# EAGLE schematic clock_from_gps (EAGLE 6.1)
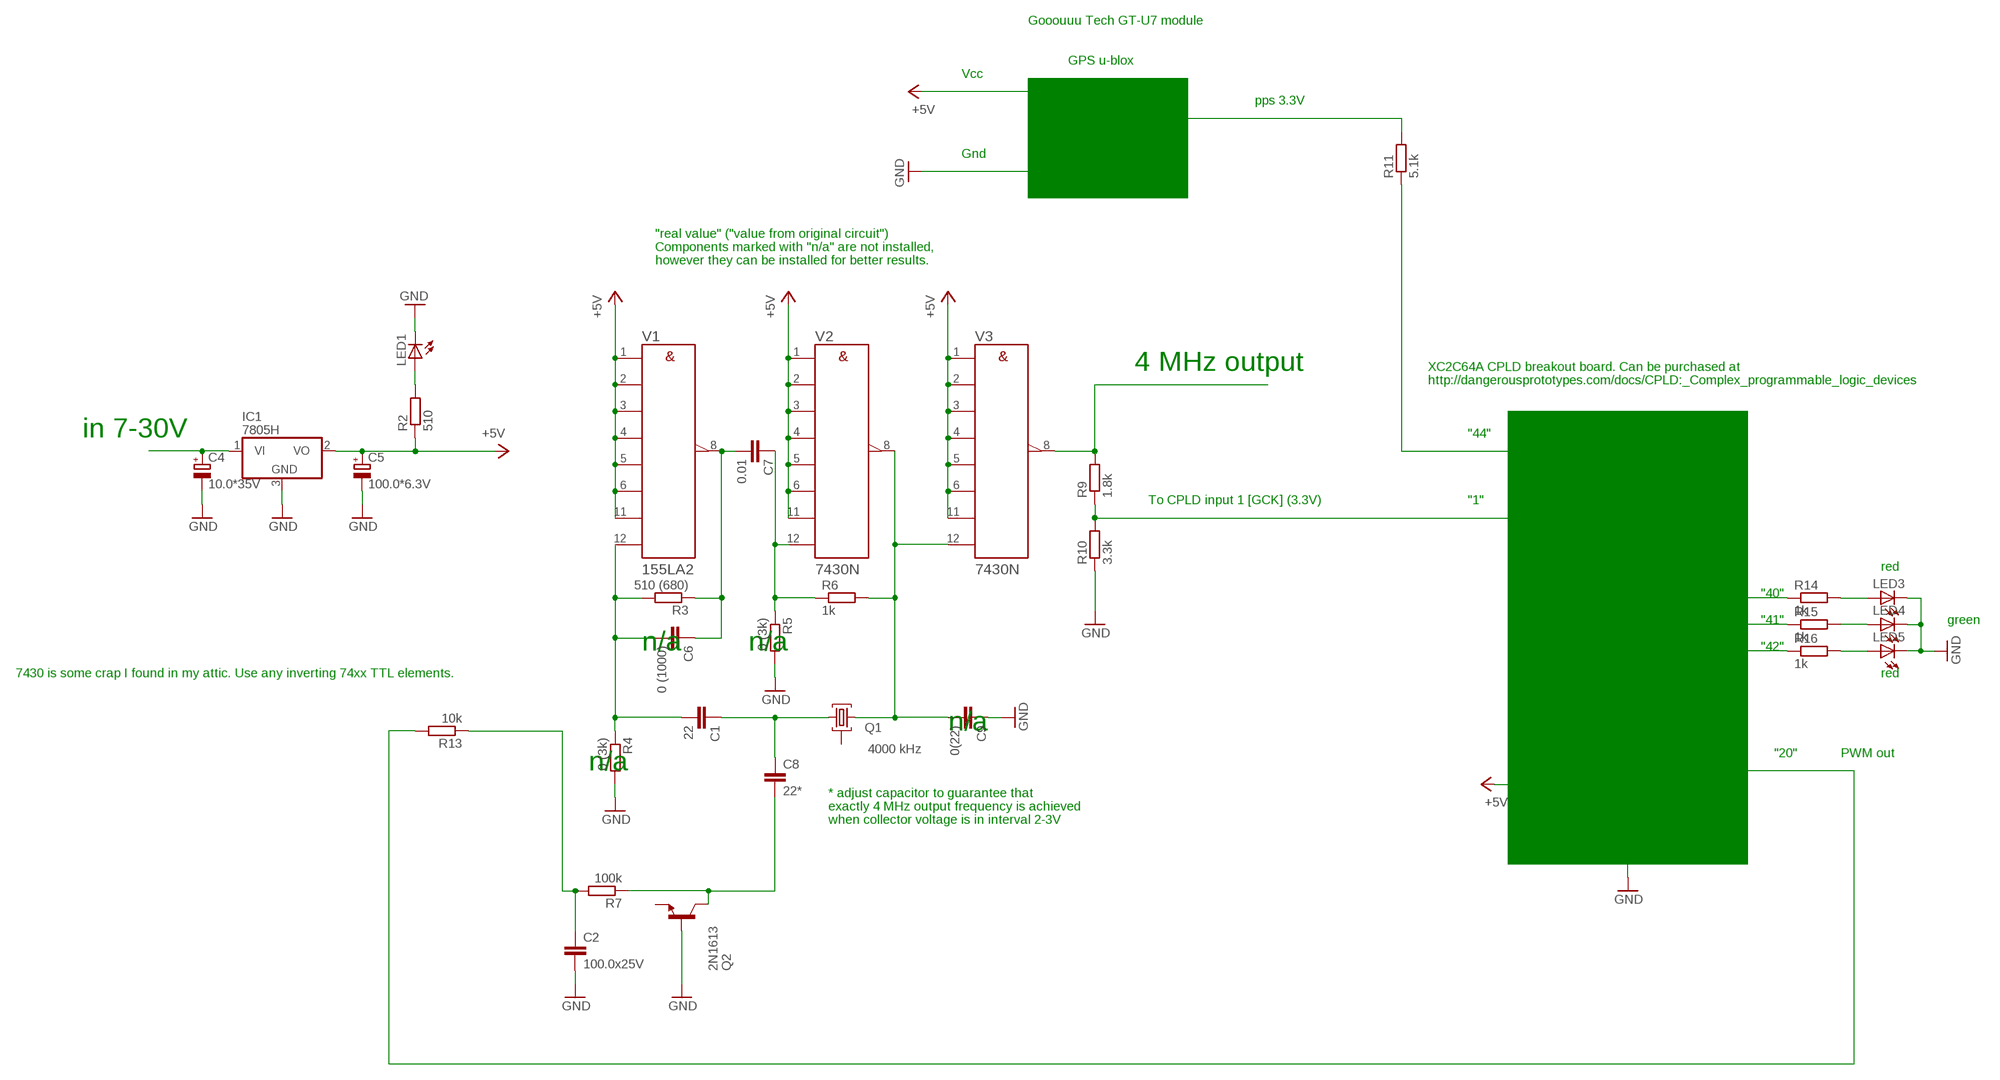
[diagram p0: schematic, sheet 1]

## Parts
C1  22  C-EU025-024X044  [C025-024X044]
C2  100.0x25V  C-EU025-024X044  [C025-024X044]
C4  10.0*35V  CPOL-EUE5-4  [E5-4]
C5  100.0*6.3V  CPOL-EUE5-4  [E5-4]
C6  0 (1000)  C-EU025-024X044  [C025-024X044]
C7  0.01  C-EU025-024X044  [C025-024X044]
C8  22*  C-EU025-024X044  [C025-024X044]
C9  0(22)  C-EU025-024X044  [C025-024X044]
IC1  7805H  [TO39]
LED1  LED3MM  [LED3MM]
LED3  LED  [SMARTLED-TTW]
LED4  LED  [SMARTLED-TTW]
LED5  LED  [SMARTLED-TTW]
Q1  4000 kHz  HC49GW  [HC49GW]
Q2  2N1613  [TO5]
R2  510  R-EU_0204/5  [0204/5]
R3  510 (680)  R-EU_0204/5  [0204/5]
R4  0 (3k)  R-EU_0204/5  [0204/5]
R5  0 (3k)  R-EU_0204/5  [0204/5]
R6  1k  R-EU_0204/5  [0204/5]
R7  100k  R-EU_0204/5  [0204/5]
R9  1.8k  R-EU_0204/5  [0204/5]
R10  3.3k  R-EU_0204/5  [0204/5]
R11  5.1k  R-EU_0204/5  [0204/5]
R13  10k  R-EU_0204/5  [0204/5]
R14  1k  R-EU_0204/5  [0204/5]
R15  1k  R-EU_0204/5  [0204/5]
R16  1k  R-EU_0204/5  [0204/5]
V1  155LA2  7430N  [DIL14]
V2  7430N  [DIL14]
V3  7430N  [DIL14]

## Nets
+5V: C5.+ IC1.2(VO) R2.1 V1.1(A) V1.2(B) V1.3(C) V1.4(D) V1.5(E) V1.6(F) V1.11(G) V2.1(A) V2.2(B) V2.3(C) V2.4(D) V2.5(E) V2.6(F) V2.11(G) V3.1(A) V3.2(B) V3.3(C) V3.4(D) V3.5(E) V3.6(F) V3.11(G)
GND: C2.2 C4.- C5.- C9.1 IC1.3(GND) LED1.K(C) LED3.C@1(C) LED4.C@1(C) LED5.C@1(C) Q2.2(B) R4.2 R5.2 R10.1
N$1: C1.1 C8.1 Q1.2
N$3: C2.1 R7.2 R13.1
N$4: C1.2 C6.2 R3.2 R4.1 V1.12(H)
N$5: C6.1 C7.2 R3.1 V1.8(Y)
N$6: C7.1 R5.1 R6.1 V2.12(H)
N$7: C9.2 Q1.1 R6.2 V2.8(Y) V3.12(H)
N$8: R9.2 V3.8(Y)
N$9: C8.2 Q2.3(C) R7.1
N$10: C4.+ IC1.1(VI)
N$12: LED1.A R2.2
N$13: R9.1 R10.2
N$14: R13.2
N$15: LED3.A@1(A) R14.2
N$16: R11.2
N$17: R11.1
N$18: LED4.A@1(A) R15.2
N$19: LED5.A@1(A) R16.2
N$20: R15.1
N$21: R14.1
N$22: R16.1
Unconnected: Q1.3 Q2.1(E)

## Notes on the sheet
- Gooouuu Tech GT-U7 module
- GPS u-blox
- Vcc
- pps 3.3V
- Gnd
- "real value" ("value from original circuit")
- Components marked with "n/a" are not installed,
- however they can be installed for better results.
- 4 MHz output | XC2C64A CPLD breakout board. Can be purchased at
- http://dangerousprototypes.com/docs/CPLD:_Complex_programmable_logic_devices
- in 7-30V | "44"
- To CPLD input 1 [GCK] (3.3V) | "1"
- red
- "40"
- "41" | green
- n/a | n/a | "42"
- 7430 is some crap I found in my attic. Use any inverting 74xx TTL elements. | red
- n/a
- "20" | PWM out
- n/a
- * adjust capacitor to guarantee that
- exactly 4 MHz output frequency is achieved
- when collector voltage is in interval 2-3V

## Power pins joined to a net without a drawn wire
+UB: V1.14(+UB) V2.14(+UB) V3.14(+UB)
-UB: V1.7(-UB) V2.7(-UB) V3.7(-UB)

## Library data of the parts
C1 C2 C6-C9 = rcl:C-EU: CAPACITOR, European symbol
C4 C5 = rcl:CPOL-EU: POLARIZED CAPACITOR, European symbol
IC1 = linear:78*: Positive VOLTAGE REGULATOR Source: http://cache.national.com/ds/LM/LM78L05.pdf http://www.fairchildsemi.com/ds/LM/LM7805.pdf
LED1 LED3-LED5 = led:LED: LED OSRAM: - CHIPLED LG R971, LG N971, LY N971, LG Q971, LY Q971, LO R971, LY R971 LH N974, LH R974 LS Q976, LO Q976, LY Q976 LO Q996 - Hyper CHIPLED LW Q18S LB Q993, LB Q99A, LB R99A - SideLED LS A670, LO A670, LY A670, LG A670, LP A670 LB A673, LV A673, LT A673, LW A673 LH A674 LY A675 LS A676, LA A676, LO A676, LY A676, LW A676 LS A679, LY A679, LG A679 - Hyper Micro SIDELED® LS Y876, LA Y876, LO Y876, LY Y876 LT Y87S - SmartLED LW L88C, LW L88S LB L89C, LB L89S, LG L890 LS L89K, LO L89K, LY L89K LS L896, LA L896, LO L896, LY L896 - TOPLED LS T670, LO T670, LY T670, LG T670, LP T670 LSG T670, LSP T670, LSY T670, LOP T670, LYG T670 LG T671, LOG T671, LSG T671 LB T673, LV T673, LT T673, LW T673 LH T674 LS T676, LA T676, LO T676, LY T676, LB T676, LH T676, LSB T676, LW T676 LB T67C, LV T67C, LT T67C, LS T67K, LO T67K, LY T67K, LW E67C LS E67B, LA E67B, LO E67B, LY E67B, LB E67C, LV E67C, LT E67C LW T67C LS T679, LY T679, LG T679 LS T770, LO T770, LY T770, LG T770, LP T770 LB T773, LV T773, LT T773, LW T773 LH T774 LS E675, LA E675, LY E675, LS T675 LS T776, LA T776, LO T776, LY T776, LB T776 LHGB T686 LT T68C, LB T68C - Hyper Mini TOPLED® LB M676 - Mini TOPLED Santana® LG M470 LS M47K, LO M47K, LY M47K Source: http://www.osram.convergy.de LUXEON: - LUMILED® LXK2-PW12-R00, LXK2-PW12-S00, LXK2-PW14-U00, LXK2-PW14-V00 LXK2-PM12-R00, LXK2-PM12-S00, LXK2-PM14-U00 LXK2-PE12-Q00, LXK2-PE12-R00, LXK2-PE12-S00, LXK2-PE14-T00, LXK2-PE14-U00 LXK2-PB12-K00, LXK2-PB12-L00, LXK2-PB12-M00, LXK2-PB14-N00, LXK2-PB14-P00, LXK2-PB14-Q00 LXK2-PR12-L00, LXK2-PR12-M00, LXK2-PR14-Q00, LXK2-PR14-R00 LXK2-PD12-Q00, LXK2-PD12-R00, LXK2-PD12-S00 LXK2-PH12-R00, LXK2-PH12-S00 LXK2-PL12-P00, LXK2-PL12-Q00, LXK2-PL12-R00 Source: www.luxeon.com KINGBRIGHT: KA-3528ASYC Source: www.kingbright.com
Q1 = crystal:HC49GW: CRYSTAL
Q2 = transistor-npn:2N1613: NPN Transistor
R2-R7 R9-R11 R13-R16 = rcl:R-EU_: RESISTOR, European symbol
V1-V3 = 74ttl-din:74*30: 8-input NAND gate